# EAGLE design WAVE_shield (EAGLE 6.2)
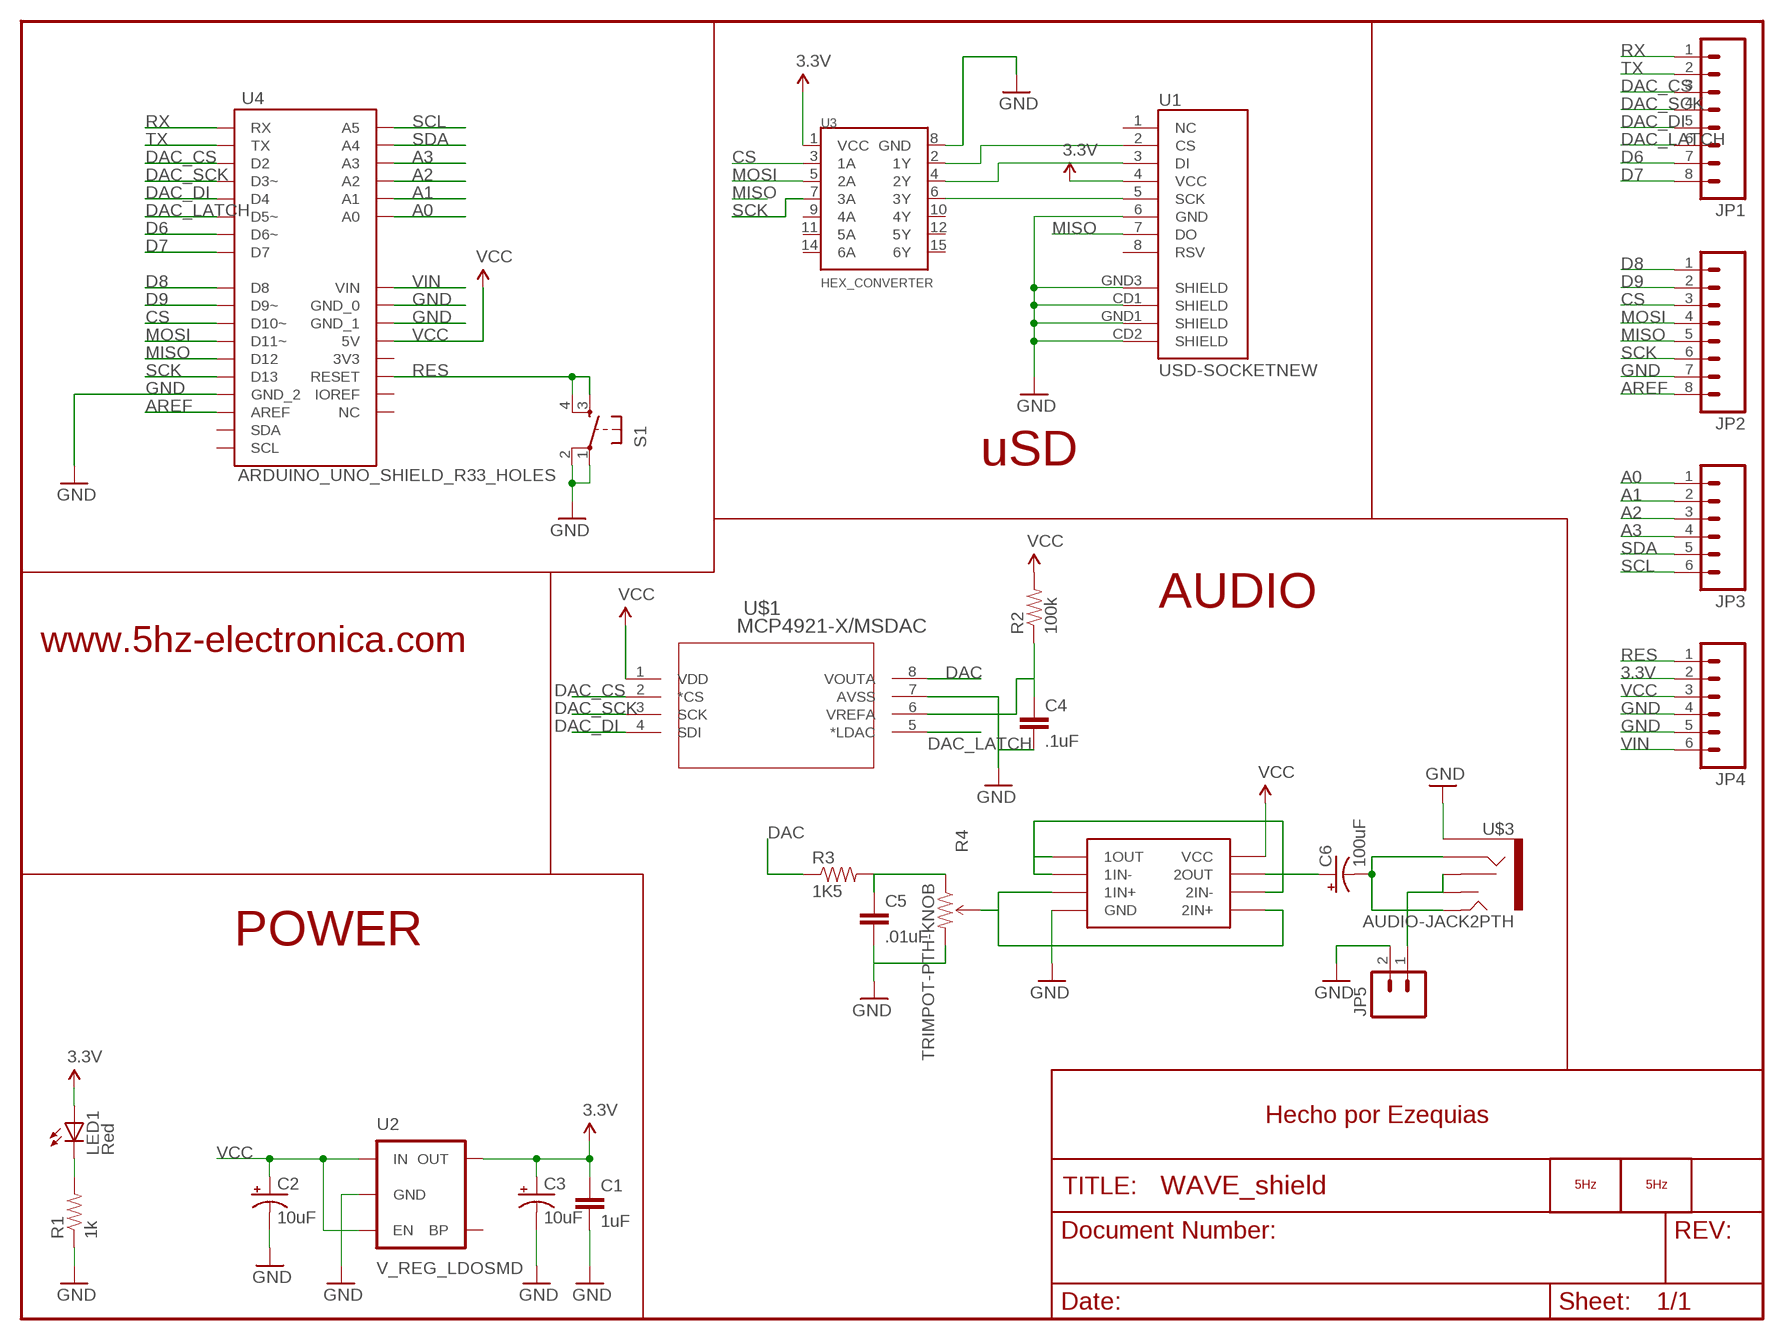
[diagram p0: schematic, sheet 1]

## Parts
C1  1uF  CAP0603-CAP  [0603-CAP]
C2  10uF  CAP_POL1206  [EIA3216]
C3  10uF  CAP_POL1206  [EIA3216]
C4  .1uF  CAP0603-CAP  [0603-CAP]
C5  .01uF  CAP0603-CAP  [0603-CAP]
C6  100uF  CAP_POL1206  [EIA3216]
JP1  M08  [1X08]
JP2  M08  [1X08]
JP3  M06SIP  [1X06]
JP4  M06SIP  [1X06]
JP5  M02PTH  [1X02]
LED1  Red  LED0603  [LED-0603]
LOGO2  LOGO_5HZ_MAIN_10MM  [5HZ_LOGO_MAIN_10MM]
LOGO3  LOGO_5HZ_H_COOPER_15MM  [5HZ_LOGO_H_COOPER_15MM]
R1  1k  RESISTOR0603-RES  [0603-RES]
R2  100k  RESISTOR0603-RES  [0603-RES]
R3  1K5  RESISTOR0603-RES  [0603-RES]
R4  TRIMPOT-PTH-KNOB  [3386U]
S1  TAC_SWITCHSMD  [TACTILE_SWITCH_SMD]
U1  USD-SOCKETNEW  [MICRO-SD-SOCKET-PP]
U2  V_REG_LDOSMD  [SOT23-5]
U3  HEX_CONVERTER  [SO016]
U4  ARDUINO_UNO_SHIELD_R33_HOLES  [UNO_R3_SHIELD_3_HOLES_NO_SILK]
U$1  MCP4921-X/MSDAC  [MSOP8_MC]
U$2  LM2904DGKROPAMP  [MSOP8]
U$3  AUDIO-JACK2PTH  [AUDIO-JACK]

## Nets
3.3V: C1.1 C3.A(+) JP4.2 LED1.A U1.4(VCC) U2.5(OUT) U3.1(VCC)
A0: JP3.1 U4.A0
A1: JP3.2 U4.A1
A2: JP3.3 U4.A2
A3: JP3.4 U4.A3
AREF: JP2.8 U4.AREF
CS: JP2.3 U3.3(1A) U4.D10(D10~)
D6: JP1.7 U4.D6(D6~)
D7: JP1.8 U4.D7
D8: JP2.1 U4.D8
D9: JP2.2 U4.D9(D9~)
DAC: R3.1 U$1.8(VOUTA)
DAC_CS: JP1.3 U4.D2 U$1.2(*CS)
DAC_DI: JP1.5 U4.D4 U$1.4(SDI)
DAC_LATCH: JP1.6 U4.D5(D5~) U$1.5(*LDAC)
DAC_SCK: JP1.4 U4.D3(D3~) U$1.3(SCK)
GND: C1.2 C2.C(-) C3.C(-) C4.2 C5.2 JP2.7 JP4.4 JP4.5 JP5.2 R1.1 R4.3(CW) S1.1 S1.2 U1.6(GND) U1.CD1(SHIELD) U1.CD2(SHIELD) U1.GND1(SHIELD) U1.GND3(SHIELD) U2.2(GND) U3.8(GND) U4.GND_0 U4.GND_1 U4.GND_2 U$1.7(AVSS) U$2.4(GND) U$3.SLEEVE
MISO: JP2.5 U1.7(DO) U4.D12
MOSI: JP2.4 U3.5(2A) U4.D11(D11~)
N$1: C5.1 R3.2 R4.1(CCW)
N$2: U1.3(DI) U3.4(2Y)
N$4: U1.5(SCK) U3.6(3Y)
N$6: LED1.C R1.2
N$163: U1.2(CS) U3.2(1Y)
N$167: R4.2(WIPER) U$2.3(1IN+) U$2.5(2IN+)
N$169: C4.1 R2.1 U$1.6(VREFA)
N$170: C6.A(+) U$2.1(1OUT) U$2.2(1IN-) U$2.6(2IN-) U$2.7(2OUT)
N$172: C6.C(-) U$3.RING U$3.TIP
N$173: JP5.1 U$3.RSH U$3.TSH
RES: JP4.1 S1.3 S1.4 U4.RES(RESET)
RX: JP1.1 U4.RX
SCK: JP2.6 U3.7(3A) U4.D13
SCL: JP3.6 U4.A5
SDA: JP3.5 U4.A4
TX: JP1.2 U4.TX
VCC: C2.A(+) JP4.3 R2.2 U2.1(IN) U2.3(EN) U4.5V U$1.1(VDD) U$2.8(VCC)
VIN: JP4.6 U4.VIN
Unconnected: U1.1(NC) U1.8(RSV) U2.4(BP) U3.9(4A) U3.10(4Y) U3.11(5A) U3.12(5Y) U3.14(6A) U3.15(6Y) U4.3.3V(3V3) U4.IOREF U4.NC U4.SCL U4.SDA

## Notes on the sheet
- uSD
- AUDIO
- www.5hz-electronica.com
- POWER
- Hecho por Ezequias

## Library data of the parts
C1 C4 C5 = SparkFun:CAP: Capacitor Standard 0603 ceramic capacitor, and 0.1" leaded capacitor.
C2 C3 C6 = SparkFun:CAP_POL: Capacitor Polarized These are standard SMD and PTH capacitors. Normally 10uF, 47uF, and 100uF in electrolytic and tantalum varieties. Always verify the external diameter of the through hole cap, it varies with capacity, voltage, and manufacturer. The EIA devices should be standard.
JP1 JP2 = SparkFun:M08: Header 8 Standard 8-pin 0.1" header. Use with straight break away headers (SKU : PRT-00116), right angle break away headers (PRT-00553), swiss pins (PRT-00743), machine pins (PRT-00117), and female headers (PRT-00115).
JP3 JP4 = SparkFun:M06: Header 6 Standard 6-pin 0.1" header. Use with straight break away headers (SKU : PRT-00116), right angle break away headers (PRT-00553), swiss pins (PRT-00743), machine pins (PRT-00117), and female headers (PRT-00115). Molex polarized connector foot print use with SKU : PRT-08094 with associated crimp pins and housings. NOTES ON THE VARIANTS LOCK and LOCK_LONGPADS... This footprint was designed to help hold the alignment of a through-hole component (i.e. 6-pin header) while soldering it into place. You may notice that each hole has been shifted either up or down by 0.005 of an inch from it's more standard position (which is a perfectly straight line). This slight alteration caused the pins (the squares in the middle) to touch the edges of the holes. Because they are alternating, it causes a "brace" to hold the component in place. 0.005 has proven to be the perfect amount of "off-center" position when using our standard breakaway headers. Although looks a little odd when you look at the bare footprint, once you have a header in there, the alteration is very hard to notice. Also, if you push a header all the way into place, it is covered up entirely on the bottom side. This idea of altering the position of holes to aid alignment will be further integrated into the Sparkfun Library for other footprints. It can help hold any component with 3 or more connection pins.
JP5 = SparkFun:M02: Header 2 Standard 2-pin 0.1" header. Use with straight break away headers (SKU : PRT-00116), right angle break away headers (PRT-00553), swiss pins (PRT-00743), machine pins (PRT-00117), and female headers (PRT-00115). Molex polarized connector foot print use with SKU : PRT-08233 with associated crimp pins and housings.
LED1 = SparkFun:LED: LEDs Standard schematic elements and footprints for 5mm, 3mm, 1206, and 0603 sized LEDs. 5mm - Spark Fun Electronics SKU : COM-00529 (and others)
LOGO2 LOGO3 = 5hz-electronica:LOGO_5HZ: Logotipo 5Hz "según Pedro"
R1-R3 = SparkFun:RESISTOR: Resistor Basic schematic elements and footprints for 0603, 1206, and PTH 1/10th watt (small) resistors.
R4 = SparkFun:TRIMPOT
S1 = SparkFun:TAC_SWITCH: Momentary Switch Button commonly used for reset or general input. Spark Fun Electronics SKU : COM-00097
U1 = SparkFun:USD-SOCKET: microSD Socket Push-push type uSD socket. Schematic element and footprint production proven. Spark Fun Electronics SKU : PRT-00127. tDoc lines correctly indicate media card edge positions when inserting (unlocked, locked, depressed).
U2 = SparkFun:V_REG_LDO: Voltage Regulator LDO Standard 150mA LDO voltage regulator in SOT-23 layout. Micrel part MIC5205. BP (by-pass) pin is used to lower output noise with 470pF cap.
U3 = SparkFun:HEX_CONVERTER
U4 = 5hz-electronica:ARDUINO_UNO_SHIELD_R3
U$1 = MCP4921:MCP4921-X/MS
U$2 = MAÑE:LM2904DGKR
U$3 = SparkFun:AUDIO-JACK2

## Board
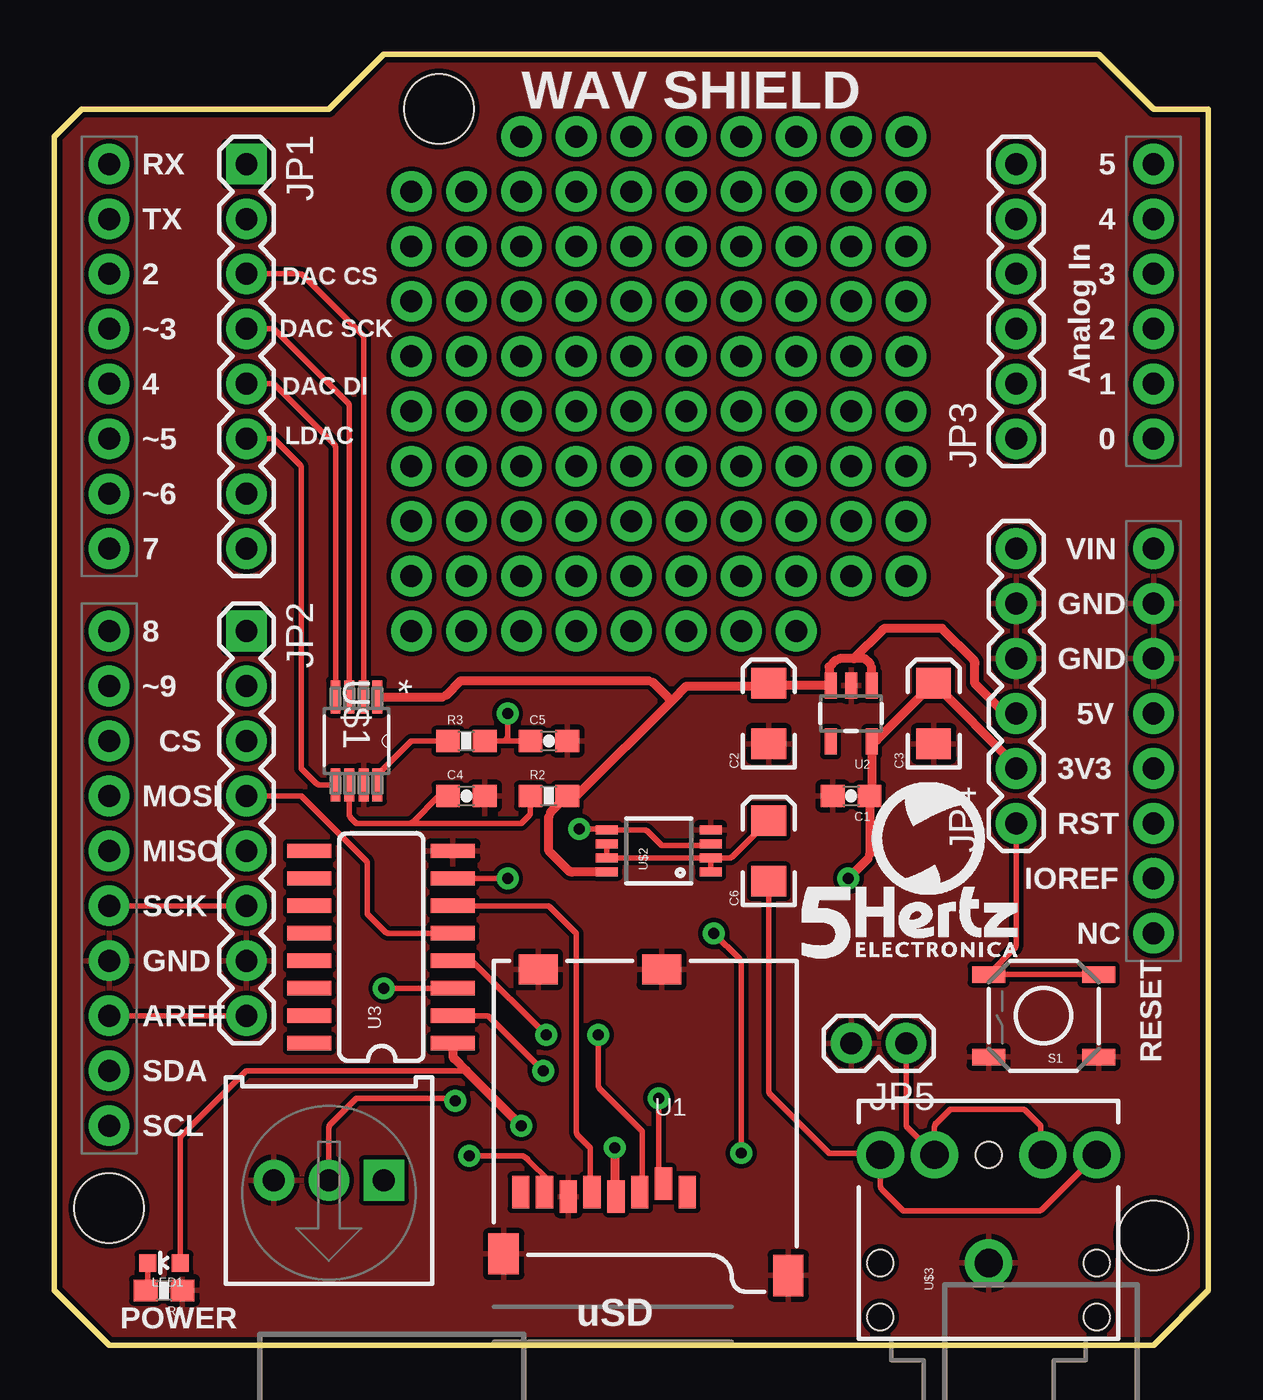
[diagram p1: board, top side]
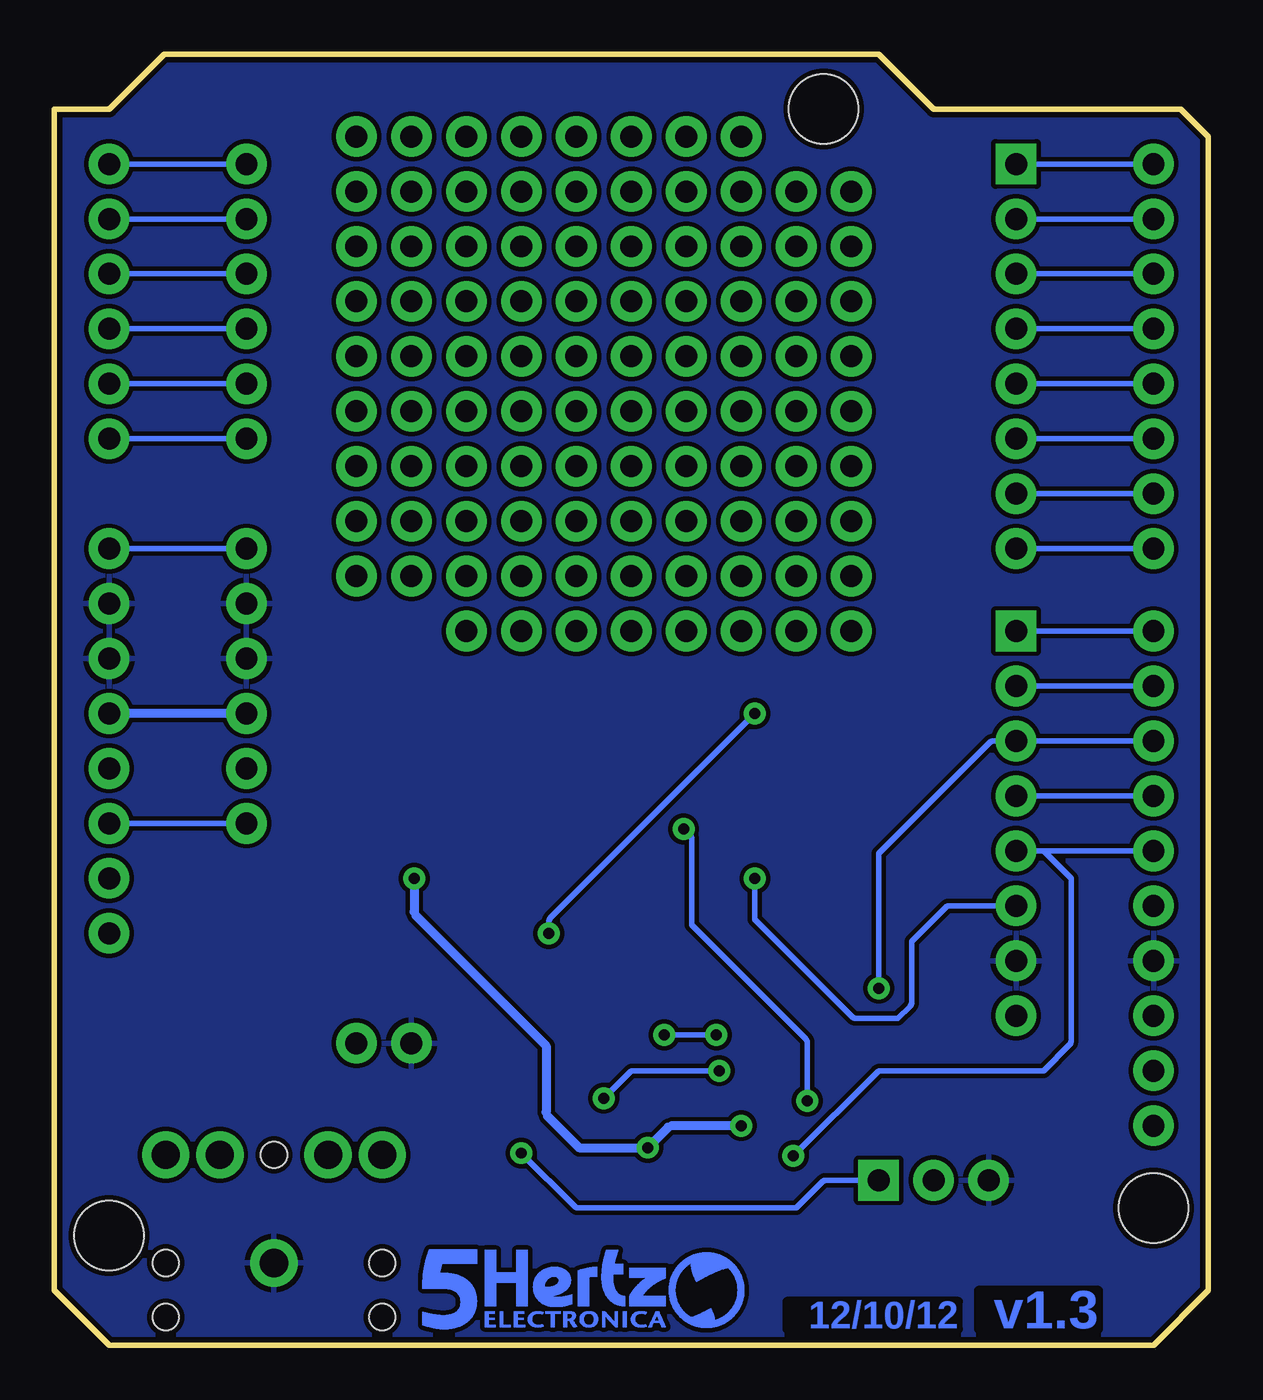
[diagram p2: board, bottom side, seen from below]

Size 53.34 x 59.69 mm. Coordinates in mm from the lower left corner, seen from the top.
Outline: 0,2.54 0,55.88 1.27,57.15 12.7,57.15 15.24,59.69 48.26,59.69 50.8,57.15 53.34,57.15 53.34,2.54 50.8,0 2.54,0 0,2.54
Copper layers (1*16): Top 0.035mm / dielectric 1.5mm / Bottom 0.035mm
Design rules: minimum track width 8mil, minimum drill 20mil, track to track 8mil, track to pad 8mil, pad to pad 8mil, via to via 8mil, smd to smd 8mil, copper to edge 10mil, drill to drill 8mil, minimum pad ring 12mil, minimum via ring 10mil, stop-mask expansion 4mil, vias tented up to drill 25mil, thermal gap 10mil

### Footprints (pad centres in the part's own frame; a part is rotated, then mirrored left to right if it is on the bottom)
0603-CAP = smd 1.1 x 1: 1 -0.85,0; 2 0.85,0
EIA3216 = smd 1.4 x 1.6: A 1.4,0; C -1.4,0
1X08 = drill 1.016 pad 1.88 square: 1 0,0 | drill 1.016 pad 1.88: 2 2.54,0; 3 5.08,0; 4 7.62,0; 5 10.16,0; 6 12.7,0; 7 15.24,0; 8 17.78,0
1X06 = drill 1.016 pad 1.88: 1 0,0; 2 2.54,0; 3 5.08,0; 4 7.62,0; 5 10.16,0; 6 12.7,0
1X02 = drill 1.016 pad 1.88: 1 0,0; 2 2.54,0
LED-0603 = smd 0.8 x 0.8: A 0,-0.75; C 0,0.75
0603-RES = smd 1.1 x 1: 1 -0.85,0; 2 0.85,0
3386U = drill 1.016 pad 1.88 square: 1 -2.54,-0.015 | drill 1.016 pad 1.88: 2 0,-0.015; 3 2.54,-0.015
TACTILE_SWITCH_SMD = smd 1.524 x 0.762: 1 -2.54,1.905; 2 2.54,1.905; 3 -2.54,-1.905; 4 2.54,-1.905
MICRO-SD-SOCKET-PP = smd 0.8 x 1.5: 1 -8.94,10.7; 2 -7.84,10.3; 3 -6.74,10.7; 4 -5.64,10.9; 5 -4.54,10.7; 6 -3.44,10.9; 7 -2.34,10.7; 8 -1.24,10.7 | smd 1.8 x 1.4: CD1 -2.05,0.4; CD2 -7.75,0.4 | smd 1.4 x 1.9: GND1 -13.6,14.55; GND3 -0.45,13.55
SOT23-5 = smd 0.55 x 1.2: 1 -0.95,-1.3; 2 0,-1.3; 3 0.95,-1.3; 4 0.95,1.3; 5 -0.95,1.3
SO016 = smd 0.66 x 2.032: 1 -4.445,-3.315; 2 -3.175,-3.315; 3 -1.905,-3.315; 4 -0.635,-3.315; 5 0.635,-3.315; 6 1.905,-3.315; 7 3.175,-3.315; 8 4.445,-3.315; 9 4.445,3.315; 10 3.175,3.315; 11 1.905,3.315; 12 0.635,3.315; 13 -0.635,3.315; 14 -1.905,3.315; 15 -3.175,3.315; 16 -4.445,3.315
UNO_R3_SHIELD_3_HOLES_NO_SILK = drill 1.016 pad 1.88: 3.3V 26.67,2.54; 5V 29.21,2.54; A0 41.91,2.54; A1 44.45,2.54; A2 46.99,2.54; A3 49.53,2.54; A4 52.07,2.54; A5 54.61,2.54; AREF 15.24,50.8; D2 49.53,50.8; D3 46.99,50.8; D4 44.45,50.8; D5 41.91,50.8; D6 39.37,50.8; D7 36.83,50.8; D8 33.02,50.8; D9 30.48,50.8; D10 27.94,50.8; D11 25.4,50.8; D12 22.86,50.8; D13 20.32,50.8; GND_0 34.29,2.54; GND_1 31.75,2.54; GND_2 17.78,50.8; IOREF 21.59,2.54; NC 19.05,2.54; RES 24.13,2.54; RX 54.61,50.8; SCL 10.16,50.8; SDA 12.7,50.8; TX 52.07,50.8; VIN 36.83,2.54 | hole 3.2: 6.35,50.8; 5.08,2.54; 57.15,35.56
MSOP8_MC = smd 1.524 x 0.457: 1 -2.032,0.965; 2 -2.032,0.33; 3 -2.032,-0.33; 4 -2.032,-0.965; 5 2.032,-0.965; 6 2.032,-0.33; 7 2.032,0.33; 8 2.032,0.965
MSOP8 = smd 0.41 x 1.02: 1 -0.975,-2.4; 2 -0.325,-2.4; 3 0.325,-2.4; 4 0.975,-2.4; 5 0.975,2.4; 6 0.325,2.4; 7 -0.325,2.4; 8 -0.975,2.4
AUDIO-JACK = drill 1.3 pad 2.184: RING 5,5; RSH 5,2.5; SLEEVE 0,0; TIP 5,-5; TSH 5,-2.5 | hole 1.2: 0,5; -2.5,5; -2.5,-5; 0,-5; 5,0

### Placement (x,y rotation side)
C1  36.83,25.4 180 top
C2  33.02,29.21 90 top
C3  40.64,29.21 90 top
C4  19.05,25.4 0 top
C5  22.86,27.94 0 top
C6  33.02,22.86 90 top
JP1  8.89,54.61 270 top
JP2  8.89,33.02 270 top
JP3  44.45,41.91 90 top
JP4  44.45,24.13 90 top
JP5  39.37,13.97 180 top
LED1  5.08,3.81 90 top
LOGO2  34.54,17.91 0 top
LOGO3  36.32,0.76 0 bottom
R1  5.08,2.54 180 top
R2  22.86,25.4 0 top
R3  19.05,27.94 0 top
R4  12.7,7.62 180 top
S1  45.72,15.24 180 top
U1  20.32,17.78 180 top
U2  36.83,29.21 180 top
U3  15.11,18.41 90 top
U4  53.34,0 90 top
U$1  13.97,27.94 270 top
U$2  27.94,22.86 90 top
U$3  43.18,3.81 90 top

### Tracks (layer width: path | path; a pad name or v marks a point on that pad's centre or on a via)
3.3V  (via drill 0.51)
  Top 0.254: 37.78,25.61 arc-45 37.71,25.43 C1.1 | U2.5 37.84,27.91 arc45 38.01,27.98 | JP4.2 44.45,26.7 arc45 44.38,26.87 | 25.91,7.01 arc45 U1.4 | 37.68,22.67 arc-45 37.61,22.49 | LED1.A 5.83,9.54 arc-45 5.9,9.71 8.89,12.7 19.05,12.7
  Top 0.406: U2.5 37.78,25.61 | 38.01,27.98 C3.A 44.38,26.87 | U3.1 18.43,13.43 arc45 18.5,13.25 19.05,12.7 v21.59,10.16 | v25.91,9.14 25.91,7.01 | C1.1 37.68,22.67 | 37.61,22.49 v36.7,21.59
  Bottom 0.254: 24.79,10.16 arc-45 24.97,10.09 | 36.7,20.04 arc-45 36.63,19.86 | 30.61,10.77 arc-45 30.53,10.59
  Bottom 0.406: v21.59,10.16 24.79,10.16 | 24.97,10.09 v25.91,9.14 29.08,9.14 30.53,10.59 | v36.7,21.59 36.7,20.04 | 36.63,19.86 30.61,13.84 30.61,10.77
A0
  Bottom 0.254: JP3.1 U4.A0
A1
  Bottom 0.254: JP3.2 U4.A1
A2
  Bottom 0.254: JP3.3 U4.A2
A3
  Bottom 0.254: JP3.4 U4.A3
AREF
  Top 0.254: U4.AREF JP2.8
CS  (via drill 0.51)
  Top 0.254: v15.24,16.51 U3.3
  Bottom 0.254: U4.D10 JP2.3 9.93,27.94 arc-45 10.11,27.87 15.24,22.73 v15.24,16.51
D6
  Bottom 0.254: U4.D6 JP1.7
D7
  Bottom 0.254: U4.D7 JP1.8
D8  (via drill 0.51)
  Bottom 0.254: U4.D8 JP2.1
  other vias: 8.89,33.02
D9
  Bottom 0.254: U4.D9 JP2.2
DAC
  Top 0.254: U$1.8 14.93,26.26 arc-45 15.01,26.44 16.51,27.94 R3.1
DAC_CS
  Top 0.254: JP1.3 11.32,49.53 arc-45 11.5,49.46 14.23,46.73 arc-45 14.3,46.55 U$1.2
  Bottom 0.254: U4.D2 JP1.3
DAC_DI
  Top 0.254: U$1.4 13,41.5 arc45 12.93,41.68 10.16,44.45 JP1.5
  Bottom 0.254: U4.D4 JP1.5
DAC_LATCH
  Top 0.254: U$1.5 12.3,25.91 arc-45 12.12,25.98 11.43,26.67 11.43,40.53 arc45 11.36,40.71 10.16,41.91 JP1.6
  Bottom 0.254: U4.D5 JP1.6
DAC_SCK
  Top 0.254: U$1.3 13.64,43.41 arc45 13.56,43.59 10.16,46.99 JP1.4
  Bottom 0.254: U4.D3 JP1.4
GND
  pour Bottom: 2.54,0 0,2.54 0,55.88 1.27,57.15 12.7,57.15 15.24,59.69 48.26,59.69 50.8,57.15 53.34,57.15 53.34,2.54 50.8,0
  pour Top: 2.54,0 0,2.54 0,55.88 1.27,57.15 12.7,57.15 15.24,59.69 48.26,59.69 50.8,57.15 53.34,57.15 53.34,2.54 50.8,0
MISO  (via drill 0.51)
  Top 0.254: v19.18,8.76 21.61,8.76 arc-45 21.92,8.56 22.86,7.62 22.86,7.38 arc-45 22.79,7.21 U1.7
  Bottom 0.254: U4.D12 JP2.5 7.72,22.86 arc45 7.55,22.79 6.35,21.59 6.35,14.07 arc45 6.42,13.9 7.62,12.7 15.13,12.7 arc-45 15.31,12.63 v19.18,8.76
MOSI
  Top 0.254: U3.5 15.47,19.05 arc-45 15.29,19.12 14.48,19.94 14.48,22.25 arc45 14.4,22.43 11.43,25.4 JP2.4
  Bottom 0.254: JP2.4 U4.D11
N$1  (via drill 0.51)
  Top 0.254: R3.2 20.83,27.94 | 20.83,27.94 C5.1 | v31.75,8.89 31.75,17.68 arc45 31.68,17.85 v30.48,19.05 | v20.95,29.21 20.95,28.17 arc-45 20.88,27.99 20.83,27.94
  Bottom 0.254: R4.1 17.66,7.63 arc-45 17.84,7.56 19.05,6.35 29.11,6.35 arc45 29.28,6.42 v31.75,8.89 | v30.48,19.05 30.48,19.58 arc45 30.41,19.76 v20.95,29.21
N$2  (via drill 0.51)
  Top 0.254: U3.4 19.2,17.78 arc-45 19.38,17.71 v22.73,14.35 | v25.15,14.35 25.15,12.04 arc45 25.22,11.86 27.18,9.91 27.18,7.3 arc-45 27.1,7.12 U1.3
  Bottom 0.254: v22.73,14.35 v25.15,14.35
N$3  (via drill 1.02 pad 1.88)
  other vias: 34.29,35.56
N$4
  Top 0.254: U3.6 22.75,20.32 arc-45 22.93,20.25 24.13,19.05 24.13,9.88 arc45 24.2,9.71 24.77,9.14 24.77,7.28 arc45 24.84,7.1 U1.5
N$5  (via drill 1.02 pad 1.88)
  other vias: 31.75,35.56
N$6
  Top 0.254: LED1.C 4.33,2.64 R1.2
N$7  (via drill 1.02 pad 1.88)
  other vias: 29.21,35.56
N$8  (via drill 1.02 pad 1.88)
  other vias: 31.75,43.18
N$9  (via drill 1.02 pad 1.88)
  other vias: 26.67,35.56
N$10  (via drill 1.02 pad 1.88)
  other vias: 24.13,35.56
N$11  (via drill 1.02 pad 1.88)
  other vias: 21.59,35.56
N$12  (via drill 1.02 pad 1.88)
  other vias: 19.05,35.56
N$13  (via drill 1.02 pad 1.88)
  other vias: 16.51,35.56
N$24  (via drill 1.02 pad 1.88)
  other vias: 16.51,33.02
N$25  (via drill 1.02 pad 1.88)
  other vias: 19.05,33.02
N$26  (via drill 1.02 pad 1.88)
  other vias: 21.59,33.02
N$27  (via drill 1.02 pad 1.88)
  other vias: 24.13,33.02
N$28  (via drill 1.02 pad 1.88)
  other vias: 26.67,33.02
N$29  (via drill 1.02 pad 1.88)
  other vias: 29.21,33.02
N$30  (via drill 1.02 pad 1.88)
  other vias: 29.21,43.18
N$31  (via drill 1.02 pad 1.88)
  other vias: 31.75,33.02
N$32  (via drill 1.02 pad 1.88)
  other vias: 34.29,33.02
N$33  (via drill 1.02 pad 1.88)
  other vias: 39.37,35.56
N$34  (via drill 1.02 pad 1.88)
  other vias: 36.83,35.56
N$36  (via drill 1.02 pad 1.88)
  other vias: 34.29,43.18
N$37  (via drill 1.02 pad 1.88)
  other vias: 34.29,38.1
N$38  (via drill 1.02 pad 1.88)
  other vias: 31.75,38.1
N$39  (via drill 1.02 pad 1.88)
  other vias: 29.21,38.1
N$40  (via drill 1.02 pad 1.88)
  other vias: 26.67,38.1
N$41  (via drill 1.02 pad 1.88)
  other vias: 24.13,38.1
N$42  (via drill 1.02 pad 1.88)
  other vias: 21.59,38.1
N$43  (via drill 1.02 pad 1.88)
  other vias: 19.05,38.1
N$44  (via drill 1.02 pad 1.88)
  other vias: 16.51,38.1
N$46  (via drill 1.02 pad 1.88)
  other vias: 39.37,38.1
N$47  (via drill 1.02 pad 1.88)
  other vias: 36.83,38.1
N$48  (via drill 1.02 pad 1.88)
  other vias: 26.67,43.18
N$49  (via drill 1.02 pad 1.88)
  other vias: 24.13,43.18
N$50  (via drill 1.02 pad 1.88)
  other vias: 21.59,43.18
N$51  (via drill 1.02 pad 1.88)
  other vias: 19.05,43.18
N$52  (via drill 1.02 pad 1.88)
  other vias: 16.51,43.18
N$55  (via drill 1.02 pad 1.88)
  other vias: 16.51,40.64
N$56  (via drill 1.02 pad 1.88)
  other vias: 19.05,40.64
N$57  (via drill 1.02 pad 1.88)
  other vias: 21.59,40.64
N$58  (via drill 1.02 pad 1.88)
  other vias: 24.13,40.64
N$59  (via drill 1.02 pad 1.88)
  other vias: 26.67,40.64
N$60  (via drill 1.02 pad 1.88)
  other vias: 29.21,40.64
N$61  (via drill 1.02 pad 1.88)
  other vias: 31.75,40.64
N$62  (via drill 1.02 pad 1.88)
  other vias: 34.29,40.64
N$63  (via drill 1.02 pad 1.88)
  other vias: 39.37,43.18
N$64  (via drill 1.02 pad 1.88)
  other vias: 36.83,43.18
N$65  (via drill 1.02 pad 1.88)
  other vias: 36.83,40.64
N$66  (via drill 1.02 pad 1.88)
  other vias: 39.37,40.64
N$67  (via drill 1.02 pad 1.88)
  other vias: 34.29,45.72
N$68  (via drill 1.02 pad 1.88)
  other vias: 31.75,45.72
N$69  (via drill 1.02 pad 1.88)
  other vias: 29.21,45.72
N$70  (via drill 1.02 pad 1.88)
  other vias: 26.67,45.72
N$71  (via drill 1.02 pad 1.88)
  other vias: 24.13,45.72
N$72  (via drill 1.02 pad 1.88)
  other vias: 21.59,45.72
N$73  (via drill 1.02 pad 1.88)
  other vias: 19.05,45.72
N$74  (via drill 1.02 pad 1.88)
  other vias: 16.51,45.72
N$76  (via drill 1.02 pad 1.88)
  other vias: 39.37,45.72
N$77  (via drill 1.02 pad 1.88)
  other vias: 36.83,45.72
N$78  (via drill 1.02 pad 1.88)
  other vias: 34.29,48.26
N$79  (via drill 1.02 pad 1.88)
  other vias: 31.75,48.26
N$80  (via drill 1.02 pad 1.88)
  other vias: 29.21,48.26
N$81  (via drill 1.02 pad 1.88)
  other vias: 26.67,48.26
N$82  (via drill 1.02 pad 1.88)
  other vias: 24.13,48.26
N$83  (via drill 1.02 pad 1.88)
  other vias: 21.59,48.26
N$84  (via drill 1.02 pad 1.88)
  other vias: 19.05,48.26
N$85  (via drill 1.02 pad 1.88)
  other vias: 16.51,48.26
N$87  (via drill 1.02 pad 1.88)
  other vias: 39.37,48.26
N$88  (via drill 1.02 pad 1.88)
  other vias: 36.83,48.26
N$89  (via drill 1.02 pad 1.88)
  other vias: 34.29,50.8
N$90  (via drill 1.02 pad 1.88)
  other vias: 31.75,50.8
N$91  (via drill 1.02 pad 1.88)
  other vias: 29.21,50.8
N$92  (via drill 1.02 pad 1.88)
  other vias: 26.67,50.8
N$93  (via drill 1.02 pad 1.88)
  other vias: 24.13,50.8
N$94  (via drill 1.02 pad 1.88)
  other vias: 21.59,50.8
N$95  (via drill 1.02 pad 1.88)
  other vias: 19.05,50.8
N$96  (via drill 1.02 pad 1.88)
  other vias: 16.51,50.8
N$98  (via drill 1.02 pad 1.88)
  other vias: 39.37,50.8
N$99  (via drill 1.02 pad 1.88)
  other vias: 36.83,50.8
N$100  (via drill 1.02 pad 1.88)
  other vias: 34.29,55.88
N$101  (via drill 1.02 pad 1.88)
  other vias: 31.75,55.88
N$102  (via drill 1.02 pad 1.88)
  other vias: 29.21,55.88
N$103  (via drill 1.02 pad 1.88)
  other vias: 26.67,55.88
N$104  (via drill 1.02 pad 1.88)
  other vias: 24.13,55.88
N$105  (via drill 1.02 pad 1.88)
  other vias: 21.59,55.88
N$106  (via drill 1.02 pad 1.88)
  other vias: 19.05,53.34
N$107  (via drill 1.02 pad 1.88)
  other vias: 16.51,53.34
N$109  (via drill 1.02 pad 1.88)
  other vias: 39.37,55.88
N$110  (via drill 1.02 pad 1.88)
  other vias: 36.83,55.88
N$111  (via drill 1.02 pad 1.88)
  other vias: 21.59,53.34
N$112  (via drill 1.02 pad 1.88)
  other vias: 26.67,53.34
N$113  (via drill 1.02 pad 1.88)
  other vias: 29.21,53.34
N$114  (via drill 1.02 pad 1.88)
  other vias: 31.75,53.34
N$133  (via drill 1.02 pad 1.88)
  other vias: 34.29,53.34
N$134  (via drill 1.02 pad 1.88)
  other vias: 36.83,53.34
N$135  (via drill 1.02 pad 1.88)
  other vias: 39.37,53.34
N$163  (via drill 0.51)
  Top 0.254: U3.2 19.96,15.24 arc-45 20.14,15.17 v22.61,12.7 | v27.94,11.43 27.94,7.8 arc45 28.01,7.63 U1.2
  Bottom 0.254: v22.61,12.7 26.57,12.7 arc-45 26.74,12.63 v27.94,11.43
N$164  (via drill 1.02 pad 1.88)
  other vias: 24.13,53.34
N$167  (via drill 0.51)
  Top 0.254: U$2.3 arc-45 30.17,23.11 28.07,23.11 27.42,23.76 arc45 27.24,23.84 U$2.5 arc45 25.44,23.88 v24.26,23.88 | R4.2 12.7,10.05 arc-45 12.77,10.23 13.97,11.43 18.31,11.43 arc-45 18.49,11.36 v18.54,11.3
  Bottom 0.254: v18.54,11.3 18.54,13.99 arc-45 18.62,14.17 23.88,19.43 23.88,23.39 arc-45 23.95,23.57 v24.26,23.88
N$169
  Top 0.254: U$1.6 13.64,24.57 arc45 13.71,24.39 13.97,24.13 16.41,24.13 | 16.41,24.13 arc45 16.58,24.2 17.78,25.4 C4.1 | R2.1 22.01,24.66 arc-45 21.94,24.48 21.59,24.13 16.41,24.13
N$170
  Top 0.254: U$2.6 U$2.7 U$2.2 | U$2.2 U$2.1 | U$2.2 31.19,22.54 arc45 31.37,22.61 C6.A
N$172
  Top 0.254: U$3.TIP 45.67,6.3 arc-45 45.49,6.22 39.24,6.22 38.25,7.21 arc-45 38.18,7.39 U$3.RING U$3.RING arc45 38,8.89 35.81,8.89 33.09,11.61 arc-45 33.02,11.79 C6.C
N$173
  Top 0.254: JP5.1 39.37,10.22 arc45 39.44,10.05 U$3.RSH 40.68,10.1 arc-45 40.75,10.27 41.4,10.92 44.73,10.92 arc-45 44.91,10.85 45.59,10.16 45.59,9 arc45 45.67,8.82 U$3.TSH
RES
  Top 0.254: JP4.1 44.45,18.52 arc-45 44.38,18.34 S1.4 S1.3
  Bottom 0.254: U4.RES JP4.1
RX
  Bottom 0.254: 6.35,54.61 JP1.1 U4.RX
SCK  (via drill 0.51)
  Top 0.254: v20.95,21.59 U3.7 | U4.D13 JP2.6
  Bottom 0.254: JP2.6 11.96,20.32 arc-45 12.14,20.25 13.72,18.67 13.72,15.85 arc45 13.79,15.67 14.35,15.11 16.28,15.11 arc45 16.46,15.19 20.95,19.68 v20.95,21.59
SCL
  Bottom 0.254: JP3.6 U4.A5
SDA
  Bottom 0.254: JP3.5 U4.A4
TX
  Bottom 0.254: U4.TX JP1.2
VCC
  Top 0.254: R2.2 24.02,25.4 arc45 24.2,25.47 | C2.A 32.96,30.55 arc-45 32.79,30.48 32.51,30.48 arc-45 32.59,30.51 | 22.86,24.45 arc-45 22.93,24.62 | 37.78,31.33 arc45 37.71,31.51 | 36.3,31.75 arc45 36.12,31.68 | 35.81,30.67 arc45 U2.3 | 17.93,29.97 arc45 18.11,30.05 | 27.48,30.73 arc-45 27.66,30.66 | 28.39,29.92 arc45 28.57,29.84
  Top 0.406: 24.2,25.47 28.57,29.84 29.21,30.48 32.51,30.48 | U$2.8 23.94,21.89 arc-45 23.76,21.96 22.86,22.86 22.86,24.45 | 22.93,24.62 R2.2 | U2.1 37.78,31.33 | 37.71,31.51 37.47,31.75 36.96,31.75 | 36.96,31.75 36.3,31.75 | 36.12,31.68 35.81,31.37 35.81,30.67 | U2.3 32.59,30.51 | U$1.1 17.93,29.97 | 18.11,30.05 18.8,30.73 27.48,30.73 | 27.66,30.66 28.39,29.92 | JP4.3 44.05,29.21 arc-45 43.87,29.28 42.55,30.61 42.55,31.52 arc45 42.47,31.7 41.02,33.15 38.46,33.15 arc45 38.28,33.07 36.96,31.75
  Bottom 0.406: JP4.3 U4.5V
VIN
  Bottom 0.254: JP4.6 U4.VIN

### Text on the board
Bottom: v1.3 | 12/10/12
tPlace: WAV SHIELD | RX | 5 | TX | 4 | 2 | DAC CS | 3 | DAC SCK | ~3 | 2 | 4 | DAC DI | Analog In | 1 | LDAC | ~5 | 0 | ~6 | 7 | VIN | GND | 8 | GND | ~9 | 5V | CS | 3V3 | MOSI | RST | MISO | IOREF | SCK | NC | GND | AREF | RESET | SDA | SCL | POWER | uSD